# Altium schematic sheet epm_control_1.SchDoc
size A
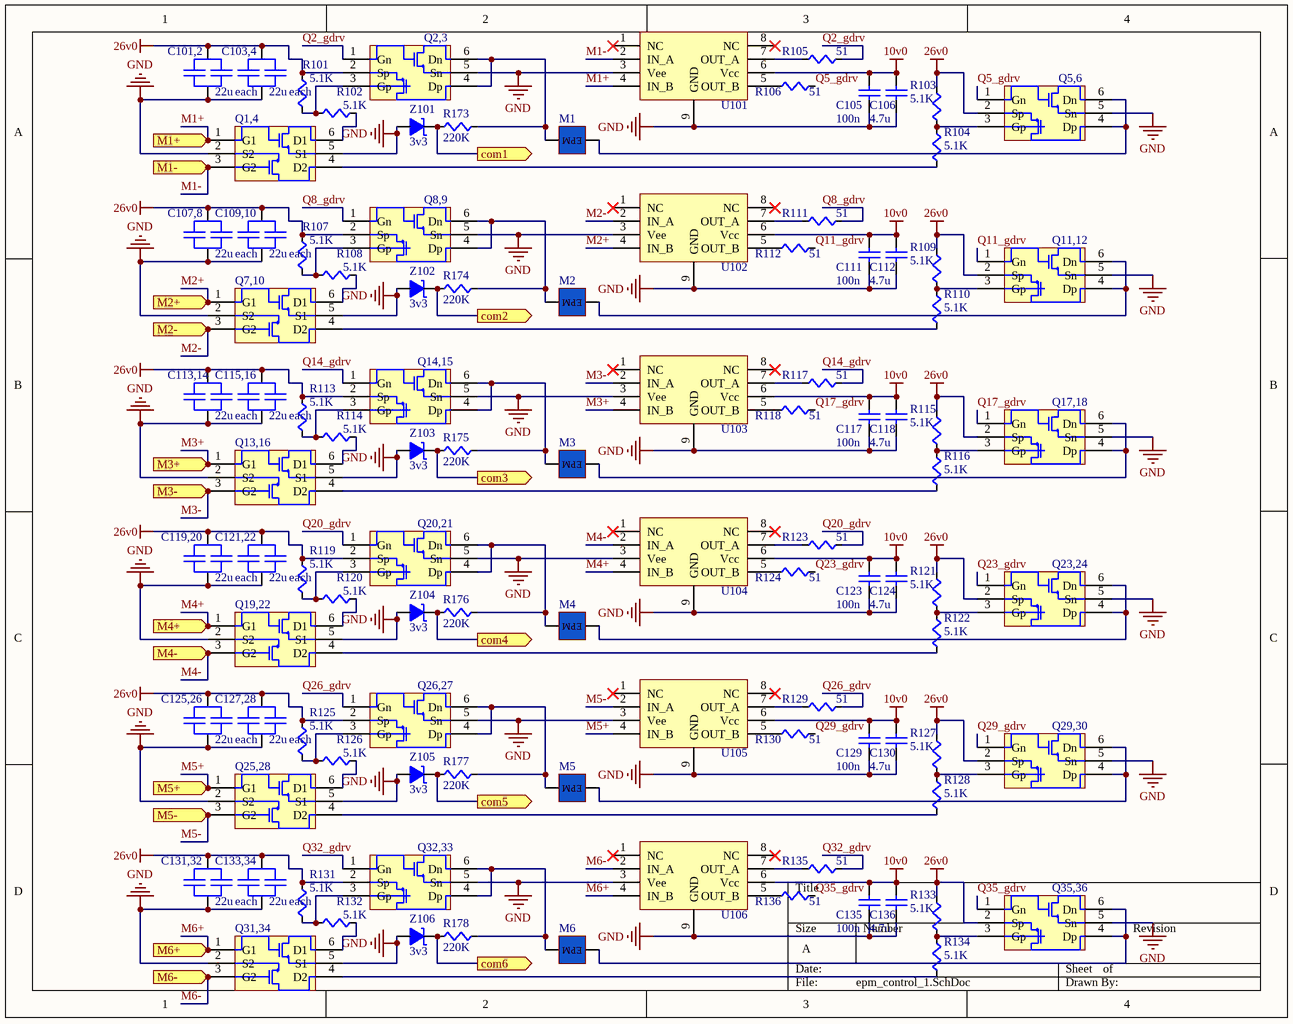
[diagram p0: epm_control_1.SchDoc]

## Parts
C101,2  value 22u  [dicap_smd_1206]  (hidden comment: Dicap)
C103,4  value 22u  [dicap_smd_1206]  (hidden comment: Dicap)
C105  value 100n  [SMD0603_cap]  (hidden comment: Cap)
C106  value 4.7u  [SMD0603_cap]  (hidden comment: Cap)
C107,8  value 22u  [dicap_smd_1206]  (hidden comment: Dicap)
C109,10  value 22u  [dicap_smd_1206]  (hidden comment: Dicap)
C111  value 100n  [SMD0603_cap]  (hidden comment: Cap)
C112  value 4.7u  [SMD0603_cap]  (hidden comment: Cap)
C113,14  value 22u  [dicap_smd_1206]  (hidden comment: Dicap)
C115,16  value 22u  [dicap_smd_1206]  (hidden comment: Dicap)
C117  value 100n  [SMD0603_cap]  (hidden comment: Cap)
C118  value 4.7u  [SMD0603_cap]  (hidden comment: Cap)
C119,20  value 22u  [dicap_smd_1206]  (hidden comment: Dicap)
C121,22  value 22u  [dicap_smd_1206]  (hidden comment: Dicap)
C123  value 100n  [SMD0603_cap]  (hidden comment: Cap)
C124  value 4.7u  [SMD0603_cap]  (hidden comment: Cap)
C125,26  value 22u  [dicap_smd_1206]  (hidden comment: Dicap)
C127,28  value 22u  [dicap_smd_1206]  (hidden comment: Dicap)
C129  value 100n  [SMD0603_cap]  (hidden comment: Cap)
C130  value 4.7u  [SMD0603_cap]  (hidden comment: Cap)
C131,32  value 22u  [dicap_smd_1206]  (hidden comment: Dicap)
C133,34  value 22u  [dicap_smd_1206]  (hidden comment: Dicap)
C135  value 100n  [SMD0603_cap]  (hidden comment: Cap)
C136  value 4.7u  [SMD0603_cap]  (hidden comment: Cap)
M1  EPM  [40awg_epm]  (value not drawn)
M2  EPM  [40awg_epm]  (value not drawn)
M3  EPM  [40awg_epm]  (value not drawn)
M4  EPM  [40awg_epm]  (value not drawn)
M5  EPM  [40awg_epm]  (value not drawn)
M6  EPM  [40awg_epm]  (value not drawn)
Q1,4  SI3292  [sot23-6l]  (value not drawn)
Q2,3  DMG6602  [sot23-6l]  (value not drawn)
Q5,6  DMG6602  [sot23-6l]  (value not drawn)
Q7,10  SI3292  [sot23-6l]  (value not drawn)
Q8,9  DMG6602  [sot23-6l]  (value not drawn)
Q11,12  DMG6602  [sot23-6l]  (value not drawn)
Q13,16  SI3292  [sot23-6l]  (value not drawn)
Q14,15  DMG6602  [sot23-6l]  (value not drawn)
Q17,18  DMG6602  [sot23-6l]  (value not drawn)
Q19,22  SI3292  [sot23-6l]  (value not drawn)
Q20,21  DMG6602  [sot23-6l]  (value not drawn)
Q23,24  DMG6602  [sot23-6l]  (value not drawn)
Q25,28  SI3292  [sot23-6l]  (value not drawn)
Q26,27  DMG6602  [sot23-6l]  (value not drawn)
Q29,30  DMG6602  [sot23-6l]  (value not drawn)
Q31,34  SI3292  [sot23-6l]  (value not drawn)
Q32,33  DMG6602  [sot23-6l]  (value not drawn)
Q35,36  DMG6602  [sot23-6l]  (value not drawn)
R101  value 5.1K  [SMD0603]  (hidden comment: Res)
R102  value 5.1K  [SMD0603]  (hidden comment: Res)
R103  value 5.1K  [SMD0603]  (hidden comment: Res)
R104  value 5.1K  [SMD0603]  (hidden comment: Res)
R105  value 51  [SMD0603]  (hidden comment: Res)
R106  value 51  [SMD0603]  (hidden comment: Res)
R107  value 5.1K  [SMD0603]  (hidden comment: Res)
R108  value 5.1K  [SMD0603]  (hidden comment: Res)
R109  value 5.1K  [SMD0603]  (hidden comment: Res)
R110  value 5.1K  [SMD0603]  (hidden comment: Res)
R111  value 51  [SMD0603]  (hidden comment: Res)
R112  value 51  [SMD0603]  (hidden comment: Res)
R113  value 5.1K  [SMD0603]  (hidden comment: Res)
R114  value 5.1K  [SMD0603]  (hidden comment: Res)
R115  value 5.1K  [SMD0603]  (hidden comment: Res)
R116  value 5.1K  [SMD0603]  (hidden comment: Res)
R117  value 51  [SMD0603]  (hidden comment: Res)
R118  value 51  [SMD0603]  (hidden comment: Res)
R119  value 5.1K  [SMD0603]  (hidden comment: Res)
R120  value 5.1K  [SMD0603]  (hidden comment: Res)
R121  value 5.1K  [SMD0603]  (hidden comment: Res)
R122  value 5.1K  [SMD0603]  (hidden comment: Res)
R123  value 51  [SMD0603]  (hidden comment: Res)
R124  value 51  [SMD0603]  (hidden comment: Res)
R125  value 5.1K  [SMD0603]  (hidden comment: Res)
R126  value 5.1K  [SMD0603]  (hidden comment: Res)
R127  value 5.1K  [SMD0603]  (hidden comment: Res)
R128  value 5.1K  [SMD0603]  (hidden comment: Res)
R129  value 51  [SMD0603]  (hidden comment: Res)
R130  value 51  [SMD0603]  (hidden comment: Res)
R131  value 5.1K  [SMD0603]  (hidden comment: Res)
R132  value 5.1K  [SMD0603]  (hidden comment: Res)
R133  value 5.1K  [SMD0603]  (hidden comment: Res)
R134  value 5.1K  [SMD0603]  (hidden comment: Res)
R135  value 51  [SMD0603]  (hidden comment: Res)
R136  value 51  [SMD0603]  (hidden comment: Res)
R173  value 220K  [SMD0603]  (hidden comment: Res)
R174  value 220K  [SMD0603]  (hidden comment: Res)
R175  value 220K  [SMD0603]  (hidden comment: Res)
R176  value 220K  [SMD0603]  (hidden comment: Res)
R177  value 220K  [SMD0603]  (hidden comment: Res)
R178  value 220K  [SMD0603]  (hidden comment: Res)
U101  LM5111-1  [tssop-8]  (value not drawn)
U102  LM5111-1  [tssop-8]  (value not drawn)
U103  LM5111-1  [tssop-8]  (value not drawn)
U104  LM5111-1  [tssop-8]  (value not drawn)
U105  LM5111-1  [tssop-8]  (value not drawn)
U106  LM5111-1  [tssop-8]  (value not drawn)
Z101  value 3v3  [SOD-323F]  (hidden comment: Zener)
Z102  value 3v3  [SOD-323F]  (hidden comment: Zener)
Z103  value 3v3  [SOD-323F]  (hidden comment: Zener)
Z104  value 3v3  [SOD-323F]  (hidden comment: Zener)
Z105  value 3v3  [SOD-323F]  (hidden comment: Zener)
Z106  value 3v3  [SOD-323F]  (hidden comment: Zener)

## Ports
com1 (out), com2 (out), com3 (out), com4 (out), com5 (out), com6 (out), M1+ (in), M1- (in), M2+ (in), M2- (in), M3+ (in), M3- (in), M4+ (in), M4- (in), M5+ (in), M5- (in), M6+ (in), M6- (in)

## Nets
10v0: C105.2 C106.2 C111.2 C112.2 C117.2 C118.2 C123.2 C124.2 C129.2 C130.2 C135.2 C136.2 U101.6(Vcc) U102.6(Vcc) U103.6(Vcc) U104.6(Vcc) U105.6(Vcc) U106.6(Vcc)
26v0: C101,2.2 C103,4.2 C107,8.2 C109,10.2 C113,14.2 C115,16.2 C119,20.2 C121,22.2 C125,26.2 C127,28.2 C131,32.2 C133,34.2 Q2,3.2(Sp) Q5,6.2(Sp) Q8,9.2(Sp) Q11,12.2(Sp) Q14,15.2(Sp) Q17,18.2(Sp) Q20,21.2(Sp) Q23,24.2(Sp) Q26,27.2(Sp) Q29,30.2(Sp) Q32,33.2(Sp) Q35,36.2(Sp) R101.2 R103.2 R107.2 R109.2 R113.2 R115.2 R119.2 R121.2 R125.2 R127.2 R131.2 R133.2
GND: C101,2.1 C103,4.1 C105.1 C106.1 C107,8.1 C109,10.1 C111.1 C112.1 C113,14.1 C115,16.1 C117.1 C118.1 C119,20.1 C121,22.1 C123.1 C124.1 C125,26.1 C127,28.1 C129.1 C130.1 C131,32.1 C133,34.1 C135.1 C136.1 Q1,4.2(S2) Q1,4.5(S1) Q2,3.5(Sn) Q5,6.5(Sn) Q7,10.2(S2) Q7,10.5(S1) Q8,9.5(Sn) Q11,12.5(Sn) Q13,16.2(S2) Q13,16.5(S1) Q14,15.5(Sn) Q17,18.5(Sn) Q19,22.2(S2) Q19,22.5(S1) Q20,21.5(Sn) Q23,24.5(Sn) Q25,28.2(S2) Q25,28.5(S1) Q26,27.5(Sn) Q29,30.5(Sn) Q31,34.2(S2) Q31,34.5(S1) Q32,33.5(Sn) Q35,36.5(Sn) U101.3(Vee) U101.9(GND) U102.3(Vee) U102.9(GND) U103.3(Vee) U103.9(GND) U104.3(Vee) U104.9(GND) U105.3(Vee) U105.9(GND) U106.3(Vee) U106.9(GND) Z101.A Z102.A Z103.A Z104.A Z105.A Z106.A
com1: R173.1 Z101.K ; port com1
com2: R174.1 Z102.K ; port com2
com3: R175.1 Z103.K ; port com3
com4: R176.1 Z104.K ; port com4
com5: R177.1 Z105.K ; port com5
com6: R178.1 Z106.K ; port com6
M1+: Q1,4.1(G1) U101.4(IN_B) ; port M1+
M1-: Q1,4.3(G2) U101.2(IN_A) ; port M1-
M2+: Q7,10.1(G1) U102.4(IN_B) ; port M2+
M2-: Q7,10.3(G2) U102.2(IN_A) ; port M2-
M3+: Q13,16.1(G1) U103.4(IN_B) ; port M3+
M3-: Q13,16.3(G2) U103.2(IN_A) ; port M3-
M4+: Q19,22.1(G1) U104.4(IN_B) ; port M4+
M4-: Q19,22.3(G2) U104.2(IN_A) ; port M4-
M5+: Q25,28.1(G1) U105.4(IN_B) ; port M5+
M5-: Q25,28.3(G2) U105.2(IN_A) ; port M5-
M6+: Q31,34.1(G1) U106.4(IN_B) ; port M6+
M6-: Q31,34.3(G2) U106.2(IN_A) ; port M6-
Q2_gdrv: Q2,3.1(Gn) R105.1
Q5_gdrv: Q5,6.1(Gn) R106.1
Q8_gdrv: Q8,9.1(Gn) R111.1
Q11_gdrv: Q11,12.1(Gn) R112.1
Q14_gdrv: Q14,15.1(Gn) R117.1
Q17_gdrv: Q17,18.1(Gn) R118.1
Q20_gdrv: Q20,21.1(Gn) R123.1
Q23_gdrv: Q23,24.1(Gn) R124.1
Q26_gdrv: Q26,27.1(Gn) R129.1
Q29_gdrv: Q29,30.1(Gn) R130.1
Q32_gdrv: Q32,33.1(Gn) R135.1
Q35_gdrv: Q35,36.1(Gn) R136.1
NetM1_1: M1.1 Q5,6.4(Dp) Q5,6.6(Dn)
NetM1_2: M1.2 Q2,3.4(Dp) Q2,3.6(Dn) R173.2
NetM2_1: M2.1 Q11,12.4(Dp) Q11,12.6(Dn)
NetM2_2: M2.2 Q8,9.4(Dp) Q8,9.6(Dn) R174.2
NetM3_1: M3.1 Q17,18.4(Dp) Q17,18.6(Dn)
NetM3_2: M3.2 Q14,15.4(Dp) Q14,15.6(Dn) R175.2
NetM4_1: M4.1 Q23,24.4(Dp) Q23,24.6(Dn)
NetM4_2: M4.2 Q20,21.4(Dp) Q20,21.6(Dn) R176.2
NetM5_1: M5.1 Q29,30.4(Dp) Q29,30.6(Dn)
NetM5_2: M5.2 Q26,27.4(Dp) Q26,27.6(Dn) R177.2
NetM6_1: M6.1 Q35,36.4(Dp) Q35,36.6(Dn)
NetM6_2: M6.2 Q32,33.4(Dp) Q32,33.6(Dn) R178.2
NetQ1,4_4: Q1,4.4(D2) R104.1
NetQ1,4_6: Q1,4.6(D1) R102.1
NetQ2,3_3: Q2,3.3(Gp) R101.1 R102.2
NetQ5,6_3: Q5,6.3(Gp) R103.1 R104.2
NetQ7,10_4: Q7,10.4(D2) R110.1
NetQ7,10_6: Q7,10.6(D1) R108.1
NetQ8,9_3: Q8,9.3(Gp) R107.1 R108.2
NetQ11,12_3: Q11,12.3(Gp) R109.1 R110.2
NetQ13,16_4: Q13,16.4(D2) R116.1
NetQ13,16_6: Q13,16.6(D1) R114.1
NetQ14,15_3: Q14,15.3(Gp) R113.1 R114.2
NetQ17,18_3: Q17,18.3(Gp) R115.1 R116.2
NetQ19,22_4: Q19,22.4(D2) R122.1
NetQ19,22_6: Q19,22.6(D1) R120.1
NetQ20,21_3: Q20,21.3(Gp) R119.1 R120.2
NetQ23,24_3: Q23,24.3(Gp) R121.1 R122.2
NetQ25,28_4: Q25,28.4(D2) R128.1
NetQ25,28_6: Q25,28.6(D1) R126.1
NetQ26,27_3: Q26,27.3(Gp) R125.1 R126.2
NetQ29,30_3: Q29,30.3(Gp) R127.1 R128.2
NetQ31,34_4: Q31,34.4(D2) R134.1
NetQ31,34_6: Q31,34.6(D1) R132.1
NetQ32,33_3: Q32,33.3(Gp) R131.1 R132.2
NetQ35,36_3: Q35,36.3(Gp) R133.1 R134.2
NetR105_2: R105.2 U101.7(OUT_A)
NetR106_2: R106.2 U101.5(OUT_B)
NetR111_2: R111.2 U102.7(OUT_A)
NetR112_2: R112.2 U102.5(OUT_B)
NetR117_2: R117.2 U103.7(OUT_A)
NetR118_2: R118.2 U103.5(OUT_B)
NetR123_2: R123.2 U104.7(OUT_A)
NetR124_2: R124.2 U104.5(OUT_B)
NetR129_2: R129.2 U105.7(OUT_A)
NetR130_2: R130.2 U105.5(OUT_B)
NetR135_2: R135.2 U106.7(OUT_A)
NetR136_2: R136.2 U106.5(OUT_B)

Not connected (* = marked no-connect by the designer): U101 1(NC)* 8(NC)*; U102 1(NC)* 8(NC)*; U103 1(NC)* 8(NC)*; U104 1(NC)* 8(NC)*; U105 1(NC)* 8(NC)*; U106 1(NC)* 8(NC)*

## Notes on the sheet
- (in symbol Dicap) each

## Library data of the parts
C105 C106 C111 C112 C117 C118 C123 C124 C129 C130 C135 C136 = Capacitor Ceramic: Ceramic Chip Capacitor
R101-R136 R173-R178 = Resistor